# EAGLE design ftdi_rs232_bsl (EAGLE 9.6.2)
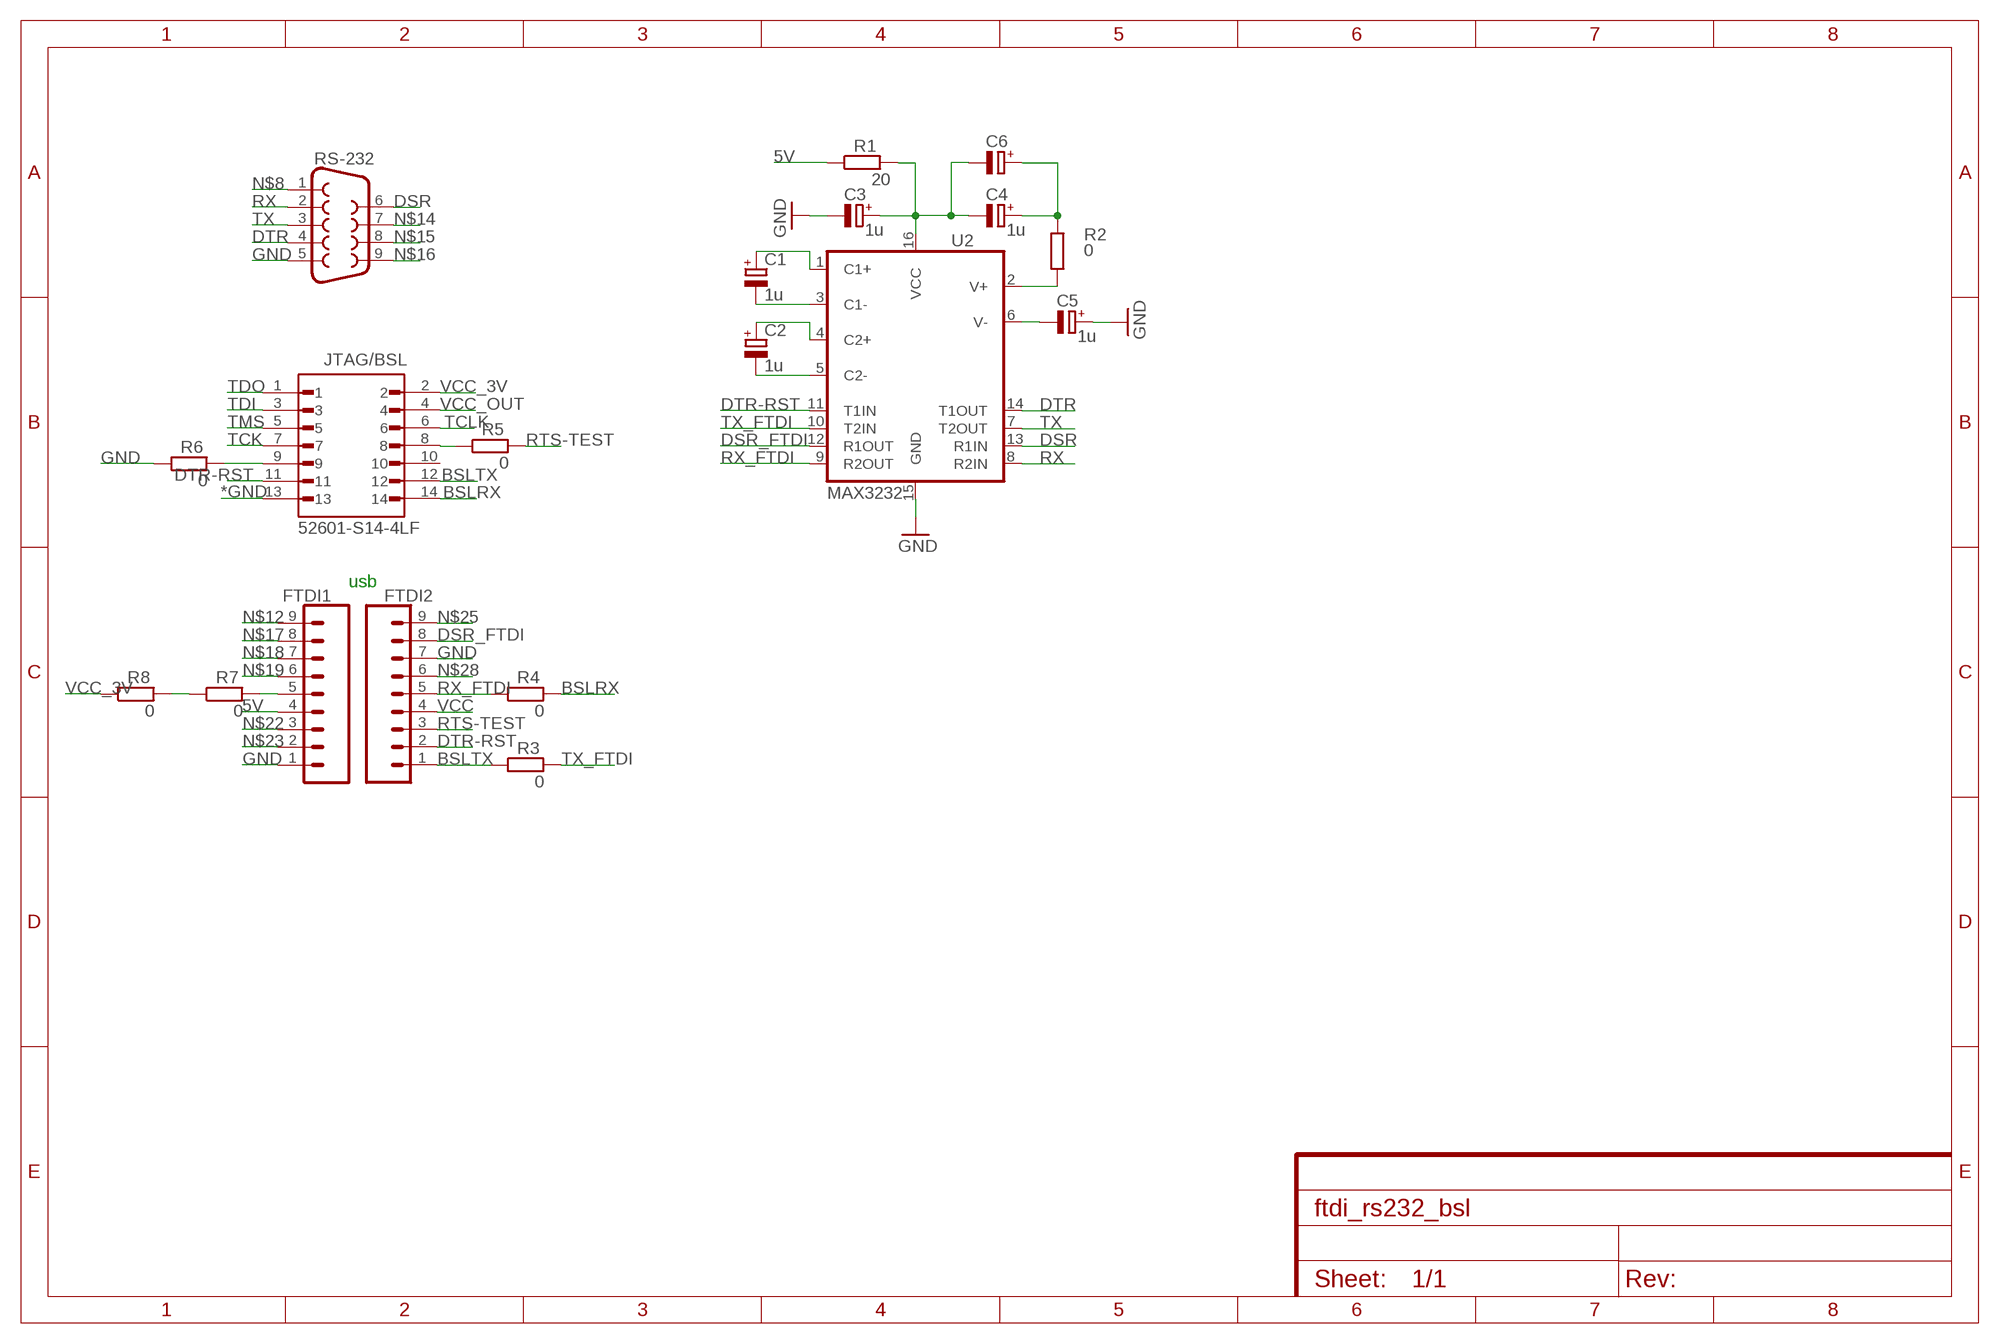
[diagram p0: schematic, sheet 1]

## Parts
C1  1u  CPOL-EUB/3528-21W  [B/3528-21W]
C2  1u  CPOL-EUB/3528-21W  [B/3528-21W]
C3  1u  CPOL-EUB/3528-21W  [B/3528-21W]
C4  1u  CPOL-EUB/3528-21W  [B/3528-21W]
C5  1u  CPOL-EUB/3528-21W  [B/3528-21W]
C6  CPOL-EUB/3528-21W  [B/3528-21W]
FTDI1  CONN_09NO_SILK  [1X09_NO_SILK]
FTDI2  CONN_09NO_SILK  [1X09_NO_SILK]
JTAG/BSL  52601-S14-4LF  [AMPHENOL_52601-S14-4LF]
R1  20  R-EU_R1206  [R1206]
R2  0  R-EU_R1206  [R1206]
R3  0  R-EU_R1206  [R1206]
R4  0  R-EU_R1206  [R1206]
R5  0  R-EU_R1206  [R1206]
R6  0  R-EU_R1206  [R1206]
R7  0  R-EU_R1206  [R1206]
R8  0  R-EU_R1206  [R1206]
RS-232  DB9MALE  [DB9_MALE]
U2  MAX3232  MAX2323PTH  [DIP16]

## Nets
5V: FTDI1.4 R1.1
*GND: JTAG/BSL.13
BSLRX: JTAG/BSL.14 R4.2
BSLTX: FTDI2.1 JTAG/BSL.12 R3.1
DSR: RS-232.6 U2.13(R1IN)
DSR_FTDI: FTDI2.8 U2.12(R1OUT)
DTR: RS-232.4 U2.14(T1OUT)
DTR-RST: FTDI2.2 JTAG/BSL.11 U2.11(T1IN)
GND: C3.- C5.+ FTDI1.1 FTDI2.7 R6.1 RS-232.5 U2.15(GND)
N$1: C1.- U2.3(C1-)
N$2: C2.- U2.5(C2-)
N$3: C1.+ U2.1(C1+)
N$4: C2.+ U2.4(C2+)
N$5: C3.+ C4.- C6.- R1.2 U2.16(VCC)
N$6: C5.- U2.6(V-)
N$7: C4.+ C6.+ R2.2
N$8: RS-232.1
N$9: R2.1 U2.2(V+)
N$10: JTAG/BSL.8 R5.1
N$11: JTAG/BSL.9 R6.2
N$12: FTDI1.9
N$13: FTDI1.5 R7.2
N$14: RS-232.7
N$15: RS-232.8
N$16: RS-232.9
N$17: FTDI1.8
N$18: FTDI1.7
N$19: FTDI1.6
N$20: R7.1 R8.2
N$22: FTDI1.3
N$23: FTDI1.2
N$25: FTDI2.9
N$28: FTDI2.6
RTS-TEST: FTDI2.3 R5.2
RX: RS-232.2 U2.8(R2IN)
RX_FTDI: FTDI2.5 R4.1 U2.9(R2OUT)
TCK: JTAG/BSL.7
TCLK: JTAG/BSL.6
TDI: JTAG/BSL.3
TDO: JTAG/BSL.1
TMS: JTAG/BSL.5
TX: RS-232.3 U2.7(T2OUT)
TX_FTDI: R3.2 U2.10(T2IN)
VCC: FTDI2.4
VCC_3V: JTAG/BSL.2 R8.1
VCC_OUT: JTAG/BSL.4
Unconnected: JTAG/BSL.10

## Notes on the sheet
- usb

## Library data of the parts
C1-C6 = rcl:CPOL-EU: POLARIZED CAPACITOR, European symbol; SPICEPREFIX: C
FTDI1 FTDI2 = SparkFun-Connectors:CONN_09: Multi connection point. Often used as Generic Header-pin footprint for 0.1 inch spaced/style header connections On any of the 0.1 inch spaced packages, you can populate with these: Break Away Headers - Straight <https://www.sparkfun.com/products/116> (PRT-00116) Break Away Male Headers - Right Angle <https://www.sparkfun.com/products/553> (PRT-00553) Female Headers <https://www.sparkfun.com/products/115> (PRT-00115) Break Away Headers - Machine Pin <https://www.sparkfun.com/products/117> (PRT-00117) Break Away Female Headers - Swiss Machine Pin <https://www.sparkfun.com/products/743> (PRT-00743) For SCREWTERMINALS and SPRING TERMINALS visit here: Screw Terimnals on SparkFun.com <https://www.sparkfun.com/search/results?term=Screw+Terminals> (5mm/3.5mm/2.54mm spacing) This device is also useful as a general connection point to wire up your design to another part of your project. Our various solder wires solder well into these plated through hole pads. Hook-Up Wire - Assortment (Stranded, 22 AWG) <https://www.sparkfun.com/products/11375> (PRT-11375) Hook-Up Wire - Assortment (Solid Core, 22 AWG) <https://www.sparkfun.com/products/11367> (PRT-11367) View the entire wire category on our website here <https://www.sparkfun.com/categories/141> Special notes: Molex polarized connector foot print use with SKU : PRT-08231 with associated crimp pins and housings. 1MM SMD Version SKU: PRT-10208 NOTES ON THE VARIANTS LOCK and LOCK_LONGPADS... This footprint was designed to help hold the alignment of a through-hole component (i.e. 6-pin header) while soldering it into place. You may notice that each hole has been shifted either up or down by 0.005 of an inch from it's more standard position (which is a perfectly straight line). This slight alteration caused the pins (the squares in the middle) to touch the edges of the holes. Because they are alternating, it causes a "brace" to hold the component in place. 0.005 has proven to be the perfect amount of "off-center" position when using our standard breakaway headers. Although looks a little odd when you look at the bare footprint, once you have a header in there, the alteration is very hard to notice. Also,if you push a header all the way into place, it is covered up entirely on the bottom side.
JTAG/BSL = 52601-S14-4LF:52601-S14-4LF: Check availability <https://pricing.snapeda.com/parts/52601-S14-4LF/Amphenol%20ICC%20%28FCI%29/view-part?ref=eda>; AVAILABILITY: In Stock; DESCRIPTION: Quickie® IDC Cable-to-Board Connector System, Shrouded Vertical Header, Through Hole, Low Profile, Double Row, 14 Positions, 2.54mm (0.100in) Pitch.; MF: Amphenol ICC (FCI); MP: 52601-S14-4LF; PACKAGE: None; PRICE: None; PURCHASE-URL: https://pricing.snapeda.com/search/part/52601-S14-4LF/?ref=eda
R1-R8 = rcl:R-EU_: RESISTOR, European symbol; SPICEPREFIX: R
RS-232 = SparkFun-Connectors:DB9: DB9 Connector Standard DB9 (D-Sub 9) serial connector. Can be used for CAN bus as well as RS485 and RS232. Footprint production proven. Here is the female version connector we sell at SparkFun: 9 Pin Female Serial Connector - PCB Mount <https://www.sparkfun.com/products/429> (PRT-00429) This connector has been used on the following SparkFun products: SparkFun RS232 Shifter - SMD <https://www.sparkfun.com/products/449> (PRT-00449) SparkFun RS232 Shifter SMD (No DB9) <https://www.sparkfun.com/products/8780> (PRT-08780); PROD_ID: CONN-09904
U2 = SparkFun-IC-Comms:MAX2323: RS232 Transceiver This part covers 232 drivers that are compatible with the MAX3232. Sipex SP3232EB Datasheet <http://cdn.sparkfun.com/datasheets/Components/General%20IC/SP3232EBCA-L.pdf> SparkFun Products SOIC component <https://www.sparkfun.com/products/589> (COM-00589 / IC-08171) Retired DIP component (COM-00316 / IC-08446) SparkFun Transceiver Breakout - MAX3232 <https://www.sparkfun.com/products/11189> (BOB-11189) SparkFun XBee Explorer Serial <https://www.sparkfun.com/products/13225> (WRL-13225); PROD_ID: IC-08446

## Board
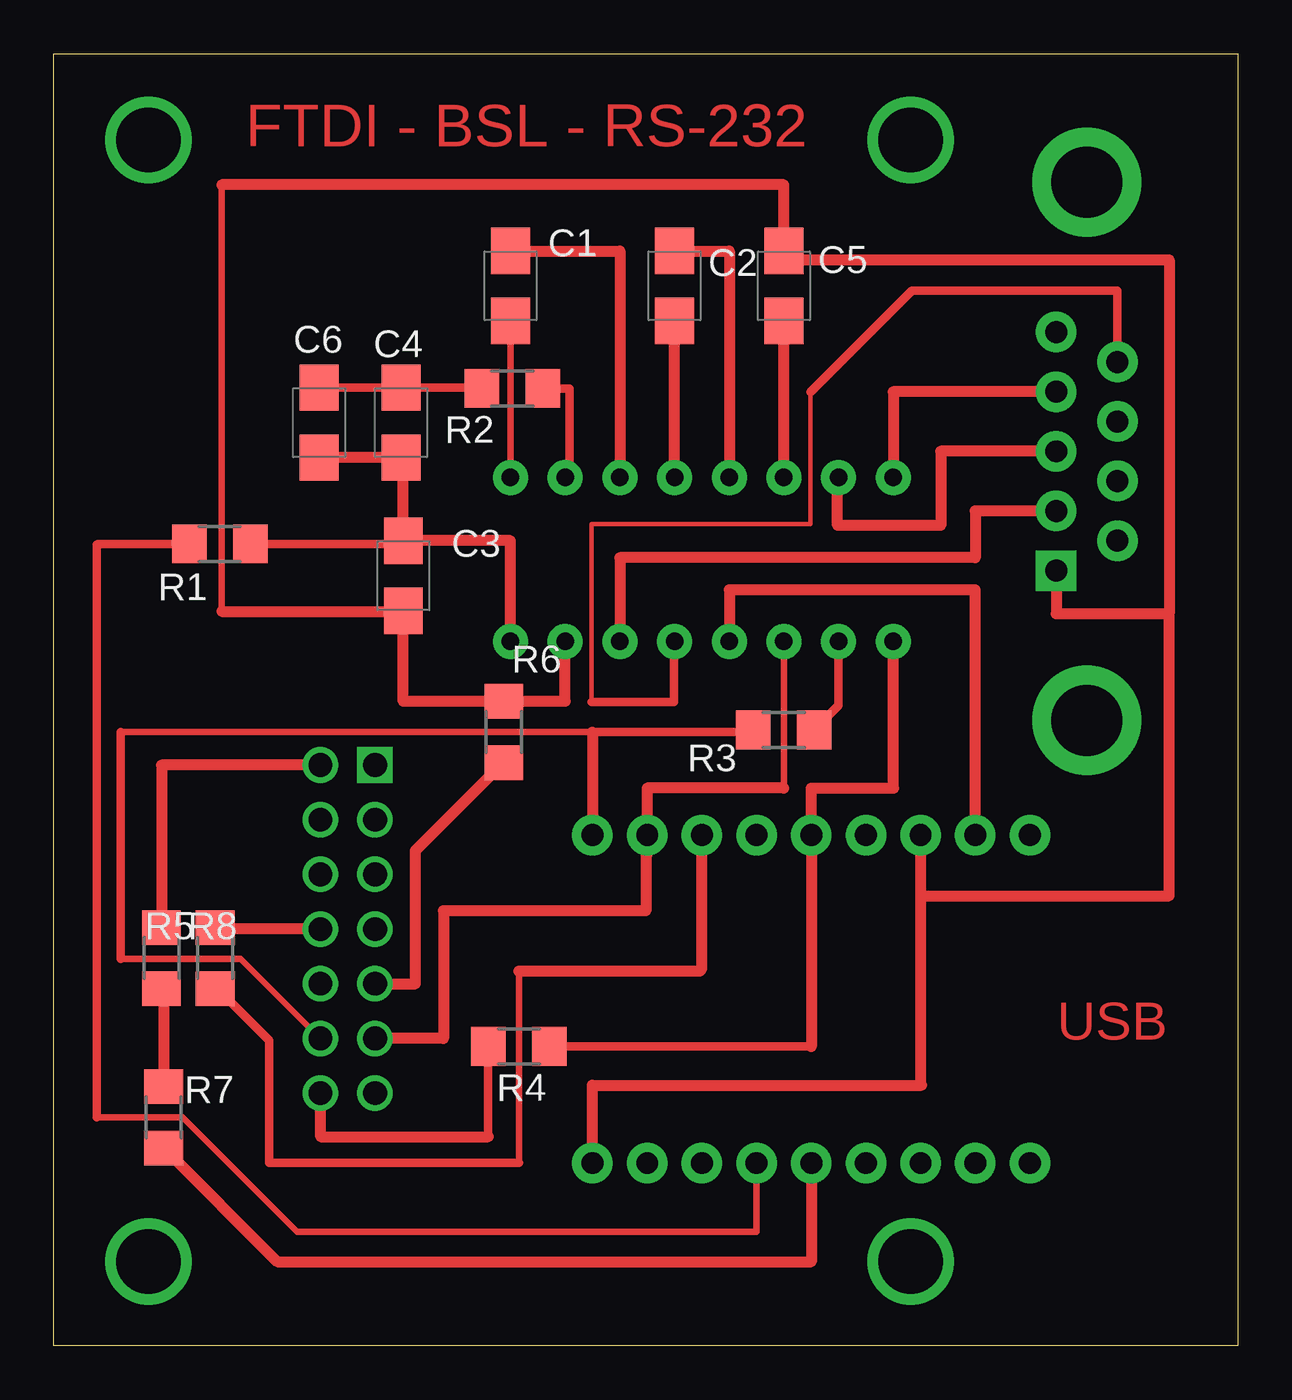
[diagram p1: board, top side]
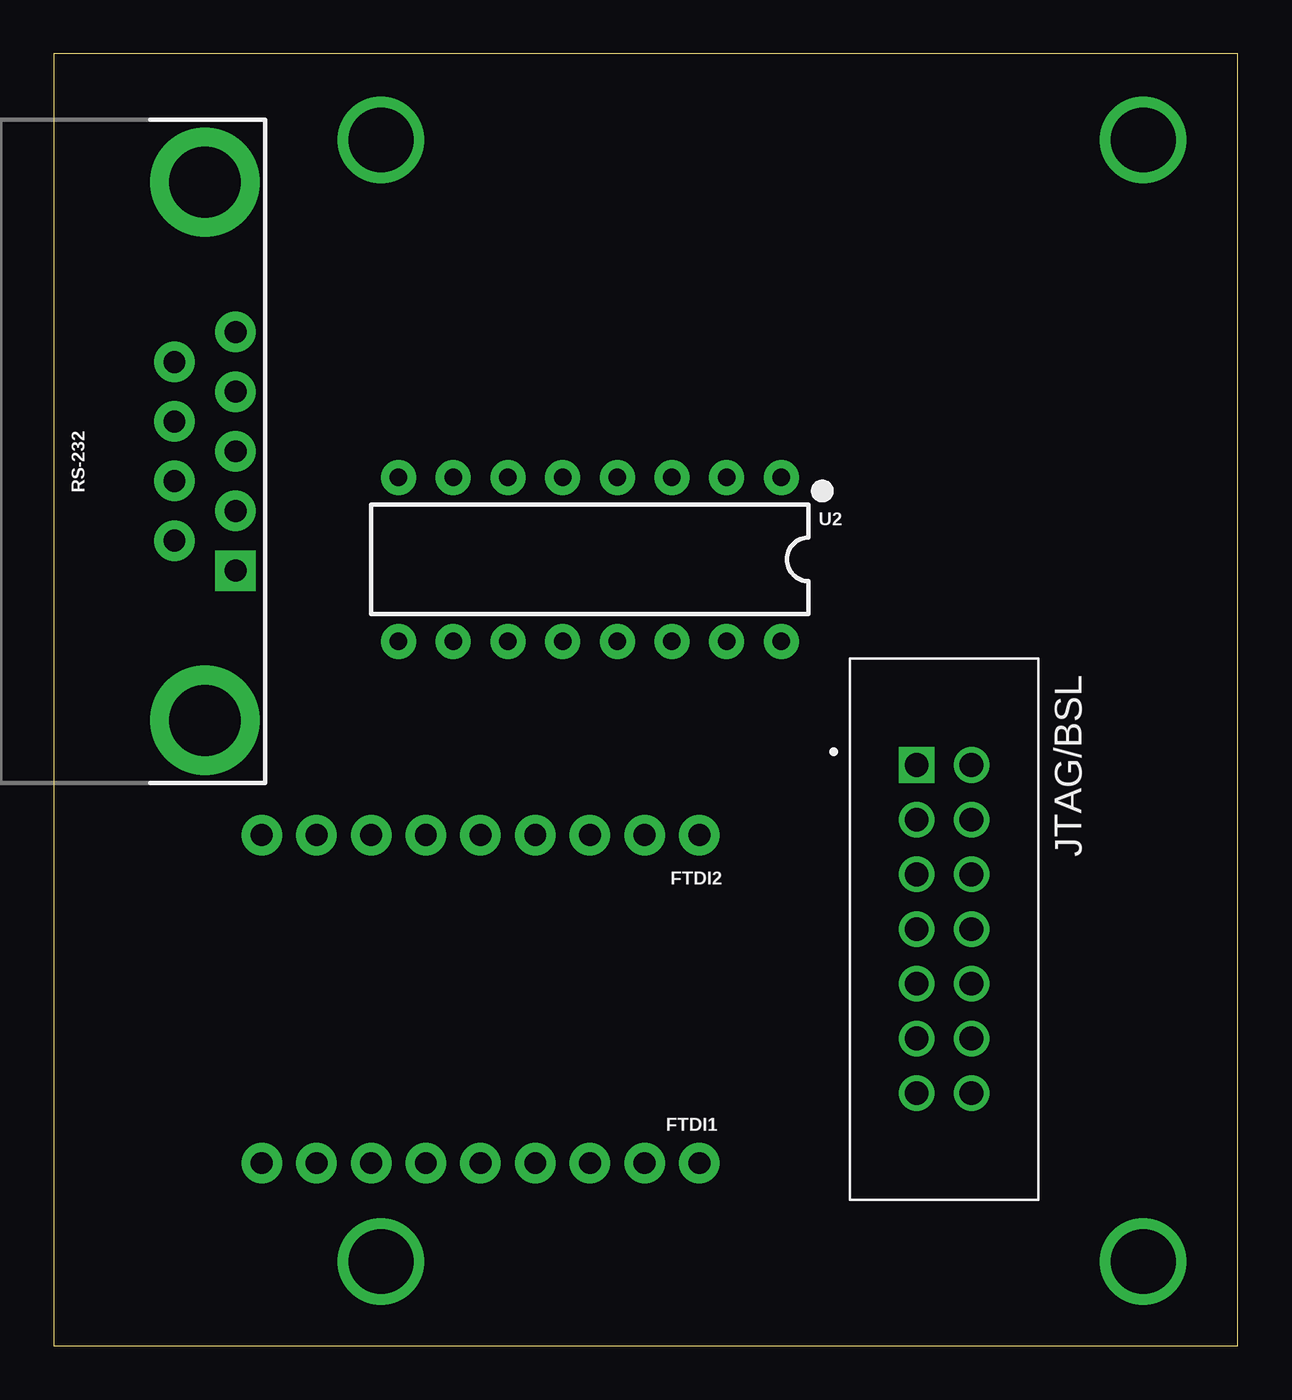
[diagram p2: board, bottom side, seen from below]

Size 55 x 60 mm. Coordinates in mm from the lower left corner, seen from the top.
Outline: 55,0 0,0 0,60 55,60 55,0
Copper layers (1*16): Top 0.035mm / dielectric 1.5mm / Bottom 0.035mm
Design rules "default": minimum track width 6mil, minimum drill 0.35mm, track to track 6mil, track to pad 6mil, pad to pad 6mil, via to via 6mil, smd to smd 6mil, copper to edge 40mil, drill to drill 6mil, minimum pad ring 10mil, minimum via ring 8mil, stop-mask expansion 4mil, vias tented up to drill 0mil, thermal gap 10mil

### Footprints (pad centres in the part's own frame; a part is rotated, then mirrored left to right if it is on the bottom)
B/3528-21W = smd 2.15 x 1.8: + 1.625,0; - -1.625,0
1X09_NO_SILK = drill 1.016 pad 1.88: 1 0,0; 2 2.54,0; 3 5.08,0; 4 7.62,0; 5 10.16,0; 6 12.7,0; 7 15.24,0; 8 17.78,0; 9 20.32,0
AMPHENOL_52601-S14-4LF = drill 1.1 square: 1 -7.62,-1.27 | drill 1.1: 2 -7.62,1.27; 3 -5.08,-1.27; 4 -5.08,1.27; 5 -2.54,-1.27; 6 -2.54,1.27; 7 0,-1.27; 8 0,1.27; 9 2.54,-1.27; 10 2.54,1.27; 11 5.08,-1.27; 12 5.08,1.27; 13 7.62,-1.27; 14 7.62,1.27
R1206 = smd 1.6 x 1.803: 1 -1.422,0; 2 1.422,0
DB9_MALE = drill 1.016 pad 1.88: 1 5.54,-1.42; 2 2.77,-1.42; 3 0,-1.42; 4 -2.77,-1.42; 6 4.15,1.42; 7 1.38,1.42; 8 -1.38,1.42; 9 -4.15,1.42 | drill 1.016 pad 1.88 square: 5 -5.54,-1.42 | drill 3.302 pad 5.08: G1 -12.5,0; G2 12.5,0
DIP16 = drill 0.813 pad 1.626: 1 -8.89,-3.81; 2 -6.35,-3.81; 3 -3.81,-3.81; 4 -1.27,-3.81; 5 1.27,-3.81; 6 3.81,-3.81; 7 6.35,-3.81; 8 8.89,-3.81; 9 8.89,3.81; 10 6.35,3.81; 11 3.81,3.81; 12 1.27,3.81; 13 -1.27,3.81; 14 -3.81,3.81; 15 -6.35,3.81; 16 -8.89,3.81

### Placement (x,y rotation side)
C1  21.21,49.22 270 top
C2  28.83,49.22 270 top
C3  16.23,35.76 90 top
C4  16.13,42.87 90 top
C5  33.91,49.22 90 top
C6  12.32,42.87 90 top
FTDI1  25.02,8.48 180 bottom
FTDI2  25.02,23.72 180 bottom
JTAG/BSL  13.65,19.35 270 bottom
R1  7.71,37.24 0 top
R2  21.29,44.46 180 top
R3  33.9,28.6 0 top
R4  21.6,13.9 180 top
R5  7.5,18 270 top
R6  20.9,28.5 270 top
R7  5.1,10.6 270 top
R8  5,18 270 top
RS-232  47.98,41.54 90 bottom
U2  30.1,36.52 180 bottom

### Tracks (layer width: path | path; a pad name or v marks a point on that pad's centre or on a via)
5V
  Top 0.3: 2,10.6 5.99,10.6 11.29,5.3 32.64,5.3 FTDI1.4
  Top 0.4: 2,10.6 2,37.2 2.04,37.24 R1.1
BSLRX
  Top 0.4: 20.18,9.7 R4.2
  Top 0.5: 20.18,9.7 12.4,9.7 12.4,11.71 JTAG/BSL.14
BSLTX
  Top 0.3: JTAG/BSL.12 8.68,17.97 3.1,17.97 | 3.1,28.5 25.02,28.5
  Top 0.4: 3.1,17.97 3.1,28.5 | R3.1 32.38,28.5 25.02,28.5
  Top 0.5: 25.02,28.5 FTDI2.1
DSR
  Top 0.2: 24.97,29.89 24.97,38.15 35.13,38.15 35.13,44.28
  Top 0.4: 24.97,29.89 28.8,29.89 28.8,32.68 | 35.13,44.28 39.85,48.99 49.4,48.99 RS-232.6
  Top 0.5: U2.13 28.8,32.68
DSR_FTDI
  Top 0.5: FTDI2.8 42.8,35.1 31.37,35.1 U2.12
DTR
  Top 0.5: RS-232.4 42.8,38.77 42.8,36.6 26.29,36.6 U2.14
DTR-RST
  Top 0.3: U2.11 33.91,25.9
  Top 0.5: 33.91,25.9 27.56,25.9 FTDI2.2 | FTDI2.2 27.56,22.82 | FTDI2.2 27.5,23.16 27.5,20.2 18.1,20.2 18.1,14.27 JTAG/BSL.11
GND
  Top 0.3: 7.8,53.92 7.8,34.1
  Top 0.5: FTDI1.1 25.02,12.1 40.3,12.1 40.26,12.14 40.26,20.9 | RS-232.5 46.56,34 51.8,34 | 51.8,34 51.8,50.42 33.91,50.42 33.91,53.92 7.8,53.92 | U2.15 23.75,29.92 16.23,29.92 C3.- 16.2,34.1 7.8,34.1 | FTDI2.7 40.26,20.9 | 40.26,20.9 51.8,20.9 51.8,34
N$1
  Top 0.5: C1.- 26.29,50.84 U2.3
N$2
  Top 0.5: C2.- 31.37,50.84 U2.5
N$3
  Top 0.3: U2.1 C1.+
N$4
  Top 0.5: U2.4 C2.+
N$5
  Top 0.4: R1.2 16.08,37.24 C3.+
  Top 0.5: C4.- 15.4,41.24 | 15.4,41.24 C6.- | 15.4,41.24 16.23,40.41 C3.+ 21.21,37.38 U2.16
N$6
  Top 0.5: U2.6 C5.-
N$7
  Top 0.4: R2.2 19.83,44.49 C4.+ C6.+
N$9
  Top 0.4: R2.1 23.95,44.46 23.95,40.53 U2.2
N$10
  Top 0.5: JTAG/BSL.8 7.5,19.35 R5.1
N$11
  Top 0.5: JTAG/BSL.9 16.8,16.81 16.8,23 20.88,27.08 R6.2
N$13
  Top 0.5: FTDI1.5 35.18,3.9 10.38,3.9 R7.2
N$20
  Top 0.5: R8.2 5.1,16.48 R7.1
N$21  (via drill 3)
  other vias: 39.8,56
N$24  (via drill 3)
  other vias: 4.4,56
N$26  (via drill 3)
  other vias: 39.8,3.9
N$27  (via drill 3)
  other vias: 4.4,3.9
RTS-TEST
  Top 0.3: 21.6,8.5 21.6,17.4
  Top 0.4: 7.6,16.58 10,14.18 10,8.5 21.6,8.5
  Top 0.5: R5.2 7.6,16.58 | 21.6,17.4 30,17.4 30.1,17.5 FTDI2.3
RX
  Top 0.5: RS-232.2 38.99,44.31 U2.8
RX_FTDI
  Top 0.4: 35.18,13.9 R4.1
  Top 0.5: U2.9 39,25.9 35.18,25.9 FTDI2.5 35.18,13.9
TX
  Top 0.5: RS-232.3 41.2,41.54 41.2,38.1 36.4,38.1 36.4,40.28 U2.7
TX_FTDI
  Top 0.4: R3.2 36.45,29.73 U2.10
VCC_3V
  Top 0.5: JTAG/BSL.2 5,26.97 R8.1

### Text on the board
Top: FTDI - BSL - RS-232 | USB